# EAGLE schematic 1 (EAGLE 7.2.0)
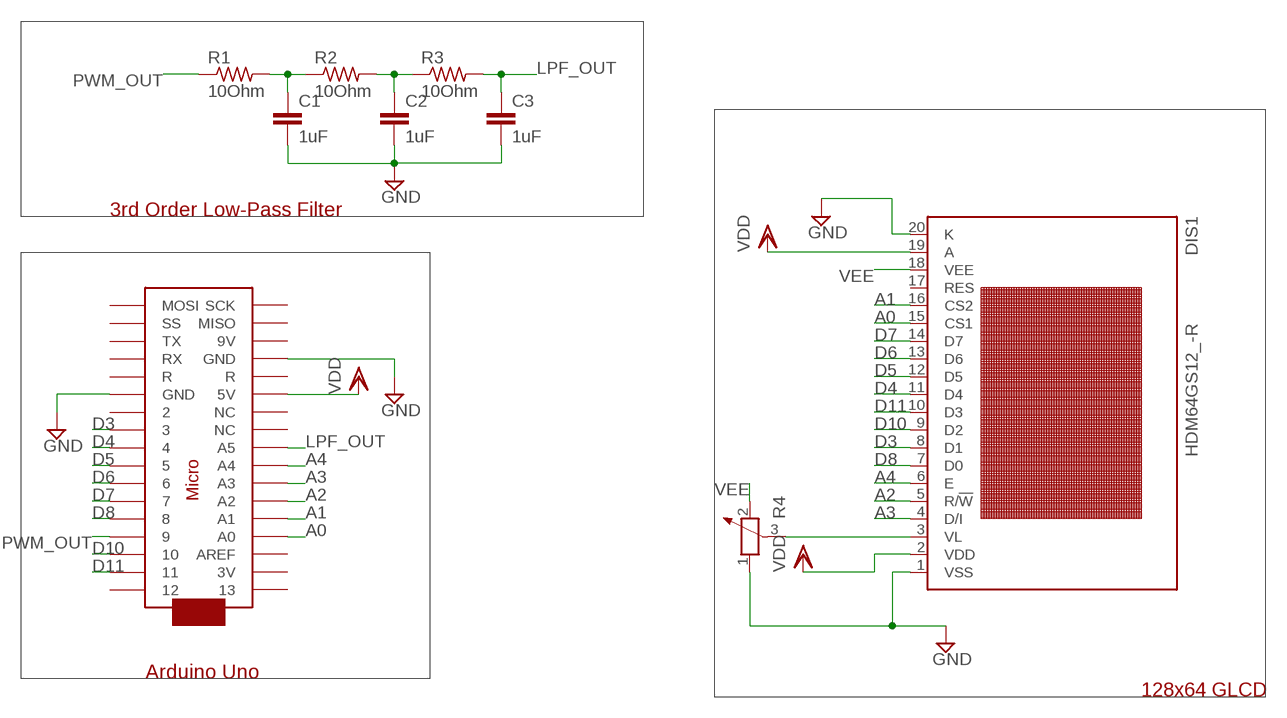
[diagram p0: schematic, sheet 1]

## Parts
C1  1uF  C-EU025-030X050  [C025-030X050]
C2  1uF  C-EU025-030X050  [C025-030X050]
C3  1uF  C-EU025-030X050  [C025-030X050]
DIS1  HDM64GS12_-R  [HDM64GS12_-R]
R1  10Ohm  R-US_0204/7  [0204/7]
R2  10Ohm  R-US_0204/7  [0204/7]
R3  10Ohm  R-US_0204/7  [0204/7]
R4  POTENTIOMETER_PT-10  [PT-10]
U$1  Arduino  ARDUINOMICRO  [ARDUINOMICRO]

## Nets
A0: DIS1.15(CS1) U$1.P$31(A0)
A1: DIS1.16(CS2) U$1.P$30(A1)
A2: DIS1.5(R/!W) U$1.P$29(A2)
A3: DIS1.4(D/I) U$1.P$28(A3)
A4: DIS1.6(E) U$1.P$27(A4)
D3: DIS1.8(D1) U$1.P$10
D4: DIS1.11(D4) U$1.P$9
D5: DIS1.12(D5) U$1.P$8
D6: DIS1.13(D6) U$1.P$7
D7: DIS1.14(D7) U$1.P$6
D8: DIS1.7(D0) U$1.P$5
D10: DIS1.9(D2) U$1.P$3
D11: DIS1.10(D3) U$1.P$2
GND: C1.2 C2.2 C3.2 DIS1.1(VSS) DIS1.20(K) R4.1 U$1.P$12(GND) U$1.P$21(GND)
LPF_OUT: C3.1 R3.2 U$1.P$26(A5)
N$1: DIS1.3(VL) R4.3
N$2: C1.1 R1.2 R2.1
N$3: C2.1 R2.2 R3.1
PWM_OUT: R1.1 U$1.P$4
VDD: DIS1.2(VDD) DIS1.19(A) U$1.P$23(5V)
VEE: DIS1.18(VEE) R4.2
Unconnected: DIS1.17(RES) U$1.P$1 U$1.P$11 U$1.P$13(R) U$1.P$14(RX) U$1.P$15(TX) U$1.P$16(SS) U$1.P$17(MOSI) U$1.P$18(SCK) U$1.P$19(MISO) U$1.P$20(9V) U$1.P$22(R) U$1.P$24(NC) U$1.P$25(NC) U$1.P$32(AREF) U$1.P$33(3V) U$1.P$34

## Notes on the sheet
- 3rd Order Low-Pass Filter
- Arduino Uno
- 128x64 GLCD

## Library data of the parts
C1-C3 = rcl:C-EU: CAPACITOR, European symbol
DIS1 = display-lcd:HDM64GS12_-R: HDM64GS12_-R 128 X 64 Dots Graphic Source: http://www.hantronix.com/down/64gs12-r.pdf; OC_FARNELL: unknown; OC_NEWARK: unknown
R1-R3 = rcl:R-US_: RESISTOR, American symbol
R4 = rcl:POTENTIOMETER_: Potentiometer
U$1 = adafruit:ARDUINOMICRO